# Altium schematic sheet 2-50Pin B2B Connector.SchDoc
size A3; SheetNumber: 8; SheetTotal: 8
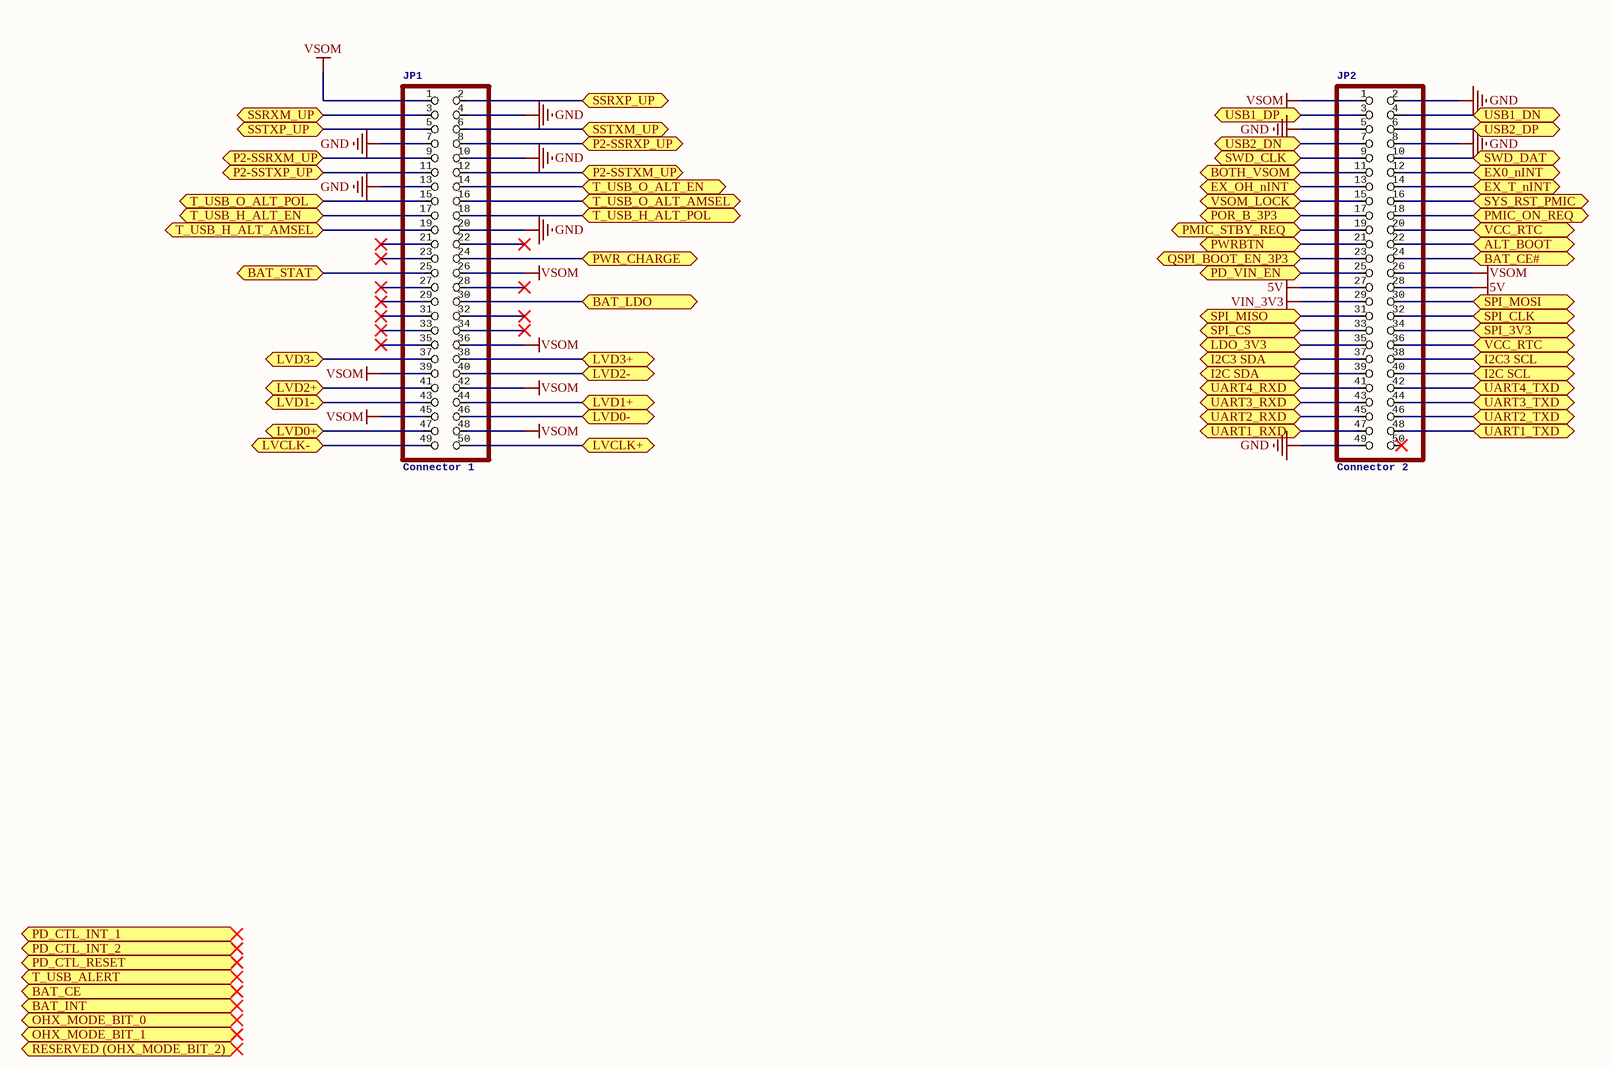
[diagram p0: 2-50Pin B2B Connector.SchDoc]

## Parts
JP1  Connector 1  [2X25]
JP2  Connector 2  [2X25]

## Ports
ALT_BOOT (bidir), BAT_CE (bidir), BAT_CE# (bidir), BAT_INT (bidir), BAT_LDO (bidir), BAT_STAT (bidir), BOTH_VSOM (bidir), EX0_nINT (bidir), EX_OH_nINT (bidir), EX_T_nINT (bidir), I2C3 SCL (bidir), I2C3 SDA (bidir), I2C SCL (bidir), I2C SDA (bidir), LDO_3V3 (bidir), LVCLK+ (bidir), LVCLK- (bidir), LVD0+ (bidir), LVD0- (bidir), LVD1+ (bidir), LVD1- (bidir), LVD2+ (bidir), LVD2- (bidir), LVD3+ (bidir), LVD3- (bidir), OHX_MODE_BIT_0 (bidir), OHX_MODE_BIT_1 (bidir), P2-SSRXM_UP (bidir), P2-SSRXP_UP (bidir), P2-SSTXM_UP (bidir), P2-SSTXP_UP (bidir), PD_CTL_INT_1 (bidir), PD_CTL_INT_2 (bidir), PD_CTL_RESET (bidir), PD_VIN_EN (bidir), PMIC_ON_REQ (bidir), PMIC_STBY_REQ (bidir), POR_B_3P3 (bidir), PWR_CHARGE (bidir), PWRBTN (bidir), QSPI_BOOT_EN_3P3 (bidir), RESERVED (OHX_MODE_BIT_2) (bidir), SPI_3V3 (bidir), SPI_CLK (bidir), SPI_CS (bidir), SPI_MISO (bidir), SPI_MOSI (bidir), SSRXM_UP (bidir), SSRXP_UP (bidir), SSTXM_UP (bidir), SSTXP_UP (bidir), SWD_CLK (bidir), SWD_DAT (bidir), SYS_RST_PMIC (bidir), T_USB_ALERT (bidir), T_USB_H_ALT_AMSEL (bidir), T_USB_H_ALT_EN (bidir), T_USB_H_ALT_POL (bidir), T_USB_O_ALT_AMSEL (bidir), T_USB_O_ALT_EN (bidir), T_USB_O_ALT_POL (bidir), UART1_RXD (bidir), UART1_TXD (bidir), UART2_RXD (bidir), UART2_TXD (bidir), UART3_RXD (bidir), UART3_TXD (bidir), UART4_RXD (bidir), UART4_TXD (bidir), USB1_DN (bidir), USB1_DP (bidir), USB2_DN (bidir), USB2_DP (bidir), VCC_RTC (bidir), VSOM_LOCK (bidir)

## Nets
5V: JP2.27 JP2.28
GND: JP1.4 JP1.7 JP1.10 JP1.13 JP1.20 JP2.2 JP2.5 JP2.8 JP2.49
VIN_3V3: JP2.29
VSOM: JP1.1 JP1.26 JP1.36 JP1.39 JP1.42 JP1.45 JP1.48 JP2.1 JP2.26
ALT_BOOT: JP2.22 ; port ALT_BOOT
BAT_CE#: JP2.24 ; port BAT_CE#
BAT_LDO: JP1.30 ; port BAT_LDO
BAT_STAT: JP1.25 ; port BAT_STAT
BOTH_VSOM: JP2.11 ; port BOTH_VSOM
EX0_nINT: JP2.12 ; port EX0_nINT
EX_OH_nINT: JP2.13 ; port EX_OH_nINT
EX_T_nINT: JP2.14 ; port EX_T_nINT
I2C3 SCL: JP2.38 ; port I2C3 SCL
I2C3 SDA: JP2.37 ; port I2C3 SDA
I2C SCL: JP2.40 ; port I2C SCL
I2C SDA: JP2.39 ; port I2C SDA
LDO_3V3: JP2.35 ; port LDO_3V3
LVCLK+: JP1.50 ; port LVCLK+
LVCLK-: JP1.49 ; port LVCLK-
LVD0+: JP1.47 ; port LVD0+
LVD0-: JP1.46 ; port LVD0-
LVD1+: JP1.44 ; port LVD1+
LVD1-: JP1.43 ; port LVD1-
LVD2+: JP1.41 ; port LVD2+
LVD2-: JP1.40 ; port LVD2-
LVD3+: JP1.38 ; port LVD3+
LVD3-: JP1.37 ; port LVD3-
P2-SSRXM_UP: JP1.9 ; port P2-SSRXM_UP
P2-SSRXP_UP: JP1.8 ; port P2-SSRXP_UP
P2-SSTXM_UP: JP1.12 ; port P2-SSTXM_UP
P2-SSTXP_UP: JP1.11 ; port P2-SSTXP_UP
PD_VIN_EN: JP2.25 ; port PD_VIN_EN
PMIC_ON_REQ: JP2.18 ; port PMIC_ON_REQ
PMIC_STBY_REQ: JP2.19 ; port PMIC_STBY_REQ
POR_B_3P3: JP2.17 ; port POR_B_3P3
PWR_CHARGE: JP1.24 ; port PWR_CHARGE
PWRBTN: JP2.21 ; port PWRBTN
QSPI_BOOT_EN_3P3: JP2.23 ; port QSPI_BOOT_EN_3P3
SPI_3V3: JP2.34 ; port SPI_3V3
SPI_CLK: JP2.32 ; port SPI_CLK
SPI_CS: JP2.33 ; port SPI_CS
SPI_MISO: JP2.31 ; port SPI_MISO
SPI_MOSI: JP2.30 ; port SPI_MOSI
SSRXM_UP: JP1.3 ; port SSRXM_UP
SSRXP_UP: JP1.2 ; port SSRXP_UP
SSTXM_UP: JP1.6 ; port SSTXM_UP
SSTXP_UP: JP1.5 ; port SSTXP_UP
SWD_CLK: JP2.9 ; port SWD_CLK
SWD_DAT: JP2.10 ; port SWD_DAT
SYS_RST_PMIC: JP2.16 ; port SYS_RST_PMIC
T_USB_H_ALT_AMSEL: JP1.19 ; port T_USB_H_ALT_AMSEL
T_USB_H_ALT_EN: JP1.17 ; port T_USB_H_ALT_EN
T_USB_H_ALT_POL: JP1.18 ; port T_USB_H_ALT_POL
T_USB_O_ALT_AMSEL: JP1.16 ; port T_USB_O_ALT_AMSEL
T_USB_O_ALT_EN: JP1.14 ; port T_USB_O_ALT_EN
T_USB_O_ALT_POL: JP1.15 ; port T_USB_O_ALT_POL
UART1_RXD: JP2.47 ; port UART1_RXD
UART1_TXD: JP2.48 ; port UART1_TXD
UART2_RXD: JP2.45 ; port UART2_RXD
UART2_TXD: JP2.46 ; port UART2_TXD
UART3_RXD: JP2.43 ; port UART3_RXD
UART3_TXD: JP2.44 ; port UART3_TXD
UART4_RXD: JP2.41 ; port UART4_RXD
UART4_TXD: JP2.42 ; port UART4_TXD
USB1_DN: JP2.4 ; port USB1_DN
USB1_DP: JP2.3 ; port USB1_DP
USB2_DN: JP2.7 ; port USB2_DN
USB2_DP: JP2.6 ; port USB2_DP
VCC_RTC: JP2.20 JP2.36 ; port VCC_RTC
VSOM_LOCK: JP2.15 ; port VSOM_LOCK

Not connected (* = marked no-connect by the designer): JP1 21* 22* 23* 27* 28* 29* 31* 32* 33* 34* 35*; JP2 50*

## Library data of the parts
JP1 JP2 = PINHD-2X25